# EAGLE design Toggle (EAGLE 7.3.0)
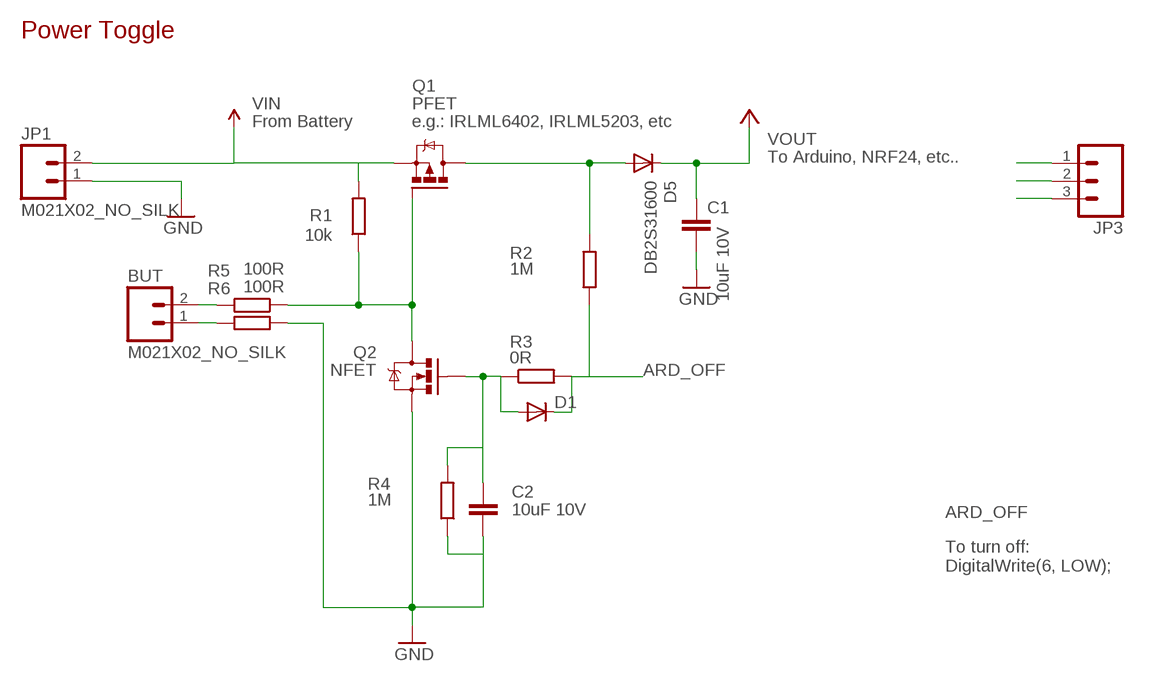
[diagram p0: schematic, sheet 1]

## Parts
BUT  M021X02_NO_SILK  [1X02_NO_SILK]
C1  10uF 10V  C-EUC0805  [C0805]
C2  10uF 10V  C-EUC0805  [C0805]
D1  DIODESOD523  [SOD523]
D5  DB2S31600  DIODESMA  [SMA-DIODE]
JP1  M021X02_NO_SILK  [1X02_NO_SILK]
JP3  M031X03_NO_SILK  [1X03_NO_SILK]
Q1  PFET  IRLML5203  [MICRO3]
Q2  NFET  MOSFET-NCHANNELBSS123LT1G  [SOT23]
R1  10k  R-EU_R0603  [R0603]
R2  1M  R-EU_R0603  [R0603]
R3  0R  R-EU_R0603  [R0603]
R4  1M  R-EU_R0603  [R0603]
R5  100R  R-EU_R0603  [R0603]
R6  100R  R-EU_R0603  [R0603]

## Nets
ARD_OFF: D1.C JP3.3 R2.1 R3.2
BUTTONS: Q1.1(G) Q2.3(D) R1.1 R5.1
GND: C1.2 C2.2 JP1.1 JP3.1 Q2.2(S) R4.1 R6.1
N$2: C2.1 D1.A Q2.1(G) R3.1 R4.2
N$3: BUT.2 R5.2
N$4: D5.A Q1.3(D) R2.2
N$5: BUT.1 R6.2
VIN: JP1.2 Q1.2(S) R1.2
VOUT: C1.1 D5.C JP3.2 ; supply symbol labelled VCC

## Notes on the sheet
- Power Toggle
- From Battery | e.g.: IRLML6402, IRLML5203, etc
- To Arduino, NRF24, etc..
- To turn off:
  DigitalWrite(6, LOW);

## Library data of the parts
BUT JP1 = SparkFun-Connectors:M02: Standard 2-pin 0.1" header. Use with - straight break away headers ( PRT-00116) - right angle break away headers (PRT-00553) - swiss pins (PRT-00743) - machine pins (PRT-00117) - female headers (PRT-00115) Molex polarized connector foot print use with: PRT-08233 with associated crimp pins and housings. 2.54_SCREWTERM for use with PRT-10571. 3.5mm Screw Terminal footprints for PRT-08084 5mm Screw Terminal footprints for use with PRT-08433
C1 C2 = wes:C-EU: CAPACITOR, European symbol
D1 D5 = SparkFun-DiscreteSemi:DIODE: Diode These are standard reverse protection diodes and small signal diodes. SMA package can handle up to about 1A. SOD-323 can handle about 200mA. What the SOD-323 package when ordering, there are some mfgs out there that are 5-pin packages.
JP3 = SparkFun-Connectors:M03: Header 3 Standard 3-pin 0.1" header. Use with straight break away headers (SKU : PRT-00116), right angle break away headers (PRT-00553), swiss pins (PRT-00743), machine pins (PRT-00117), and female headers (PRT-00115). Molex polarized connector foot print use with SKU : PRT-08232 with associated crimp pins and housings.
Q1 = transistor-power:IRLML5203: HEXFET P-Channel Power MOSFET
Q2 = SparkFun-DiscreteSemi:MOSFET-NCHANNEL: Common NMOSFET Parts MFG P/N Store ID Prod ID FDD8780 TRANS-09984 SI7820DN TRANS-11055 FDS6630A IC-08089 2N7002PW TRANS-11151 FQP30N06L COM-10213 TRANS-10060 BSS123LT1G TRANS-08345 BSS138 TRANS-00830 BS170 2N7000; PROD_ID: TRANS-08345
R1-R6 = wes:R-EU_: RESISTOR, European symbol

## Board
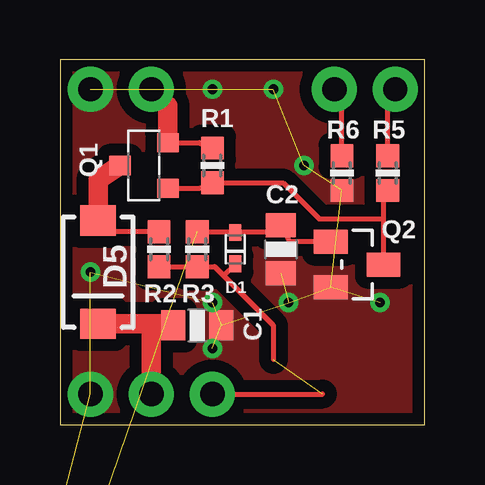
[diagram p1: board, top side]
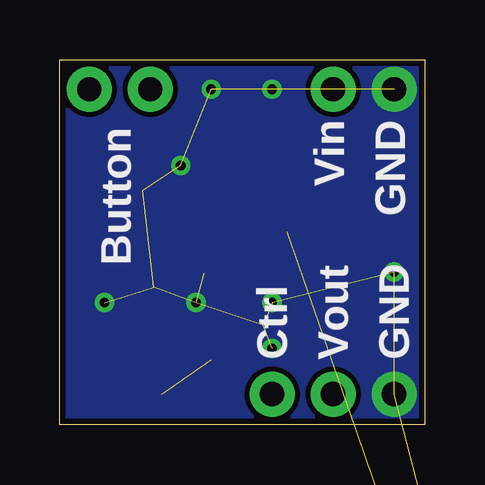
[diagram p2: board, bottom side, seen from below]

Size 15.19 x 15.19 mm. Coordinates in mm from the lower left corner, seen from the top.
Outline: 0,0 15.19,0 15.19,15.19 0,15.19 0,0
Copper layers (1*16): Top 0.035mm / dielectric 1.5mm / Bottom 0.035mm
Design rules "default *": minimum track width 8mil, minimum drill 0.3mm, track to track 8mil, track to pad 8mil, pad to pad 8mil, via to via 8mil, smd to smd 8mil, copper to edge 10mil, drill to drill 8mil, minimum pad ring 10mil, minimum via ring 8mil, stop-mask expansion 4mil, vias tented up to drill 30mil, thermal gap 10mil

### Footprints (pad centres in the part's own frame; a part is rotated, then mirrored left to right if it is on the bottom)
1X02_NO_SILK = drill 1.016 pad 1.88: 1 0,0; 2 2.54,0
C0805 = smd 1 x 1.25: 1 -1,0; 2 1,0
SOD523 = smd 0.7 x 0.5: A 0.7,0; C -0.6,0
SMA-DIODE = smd 1.27 x 1.47: A -2.15,0; C 2.15,0
1X03_NO_SILK = drill 1.016 pad 1.88: 1 0,0; 2 2.54,0; 3 5.08,0
MICRO3 = smd 0.8 x 0.9: 1 -0.95,-1; 2 0.95,-1; 3 0,1
SOT23 = smd 1 x 1.4: 1 -0.95,-1.1; 2 0.95,-1.1; 3 0,1.1
R0603 = smd 0.95 x 0.95: 1 -0.725,0; 2 0.725,0

### Placement (x,y rotation side)
BUT  11.43,13.97 0 top
C1  5.71,4.13 0 top
C2  9.21,7.3 270 top
D1  7.3,7.3 90 top
D5  1.59,6.35 270 top
JP1  1.27,13.97 0 top
JP3  1.27,1.27 0 top
Q1  3.49,10.79 90 top
Q2  12.38,6.67 270 top
R1  6.35,10.79 90 top
R2  4.13,7.3 90 top
R3  5.71,7.3 270 top
R4  0,-6.35 0 top  (outside the outline)
R5  13.65,10.48 90 top
R6  11.75,10.48 90 top

### Tracks (layer width: path | path; a pad name or v marks a point on that pad's centre or on a via)
ARD_OFF  (1 unrouted)
  Top 0.203: JP3.3 10.94,1.27 | R2.1 R3.2 6.44,6.58 6.83,6.19 | 8.89,2.71 8.89,4.13 6.83,6.19 | D1.C 7.3,6.67 6.83,6.19
BUTTONS
  Top 0.203: Q1.1 5.81,9.85 R1.1 9.3,10.07 10.79,8.57 13.48,8.57 | Q2.3 13.48,8.57 | 13.48,8.57 13.48,9.58 R5.1
GND  (via drill 0.4 pad 0.3)  (14 unrouted)
  other vias: 6.35,13.97 8.89,13.97 10.16,10.79 13.34,5.08 9.53,5.08 6.35,5.08 6.35,3.17 1.27,6.35
  pour Top (isolate 0.5, no thermals): -2.54,24.13 20.32,24.13 20.32,-3.81 -2.54,-3.81
  pour Bottom (no thermals): -2.54,17.14 17.14,17.14 17.14,-1.91 -2.54,-1.91
N$2  (1 unrouted)
  Top 0.203: R3.1 7.62,8.03 | 7.62,8.03 8.62,8.03 C2.1 9.57,7.62 Q2.1 | D1.A 7.59,8 7.62,8.03
N$3
  Top 0.203: R5.2 13.65,13.47 BUT.2
N$4
  Top 0.203: R2.2 1.74,8.03 D5.A
  Top 0.813: D5.A 1.59,10.21 Q1.3
N$5
  Top 0.203: R6.2 11.75,13.47 BUT.1
VIN
  Top 0.203: Q1.2 5.81,11.74 R1.2
  Top 0.813: Q1.2 4.49,13.29 JP1.2
VOUT
  Top 0.813: D5.C 3.81,4.2 | 3.81,4.2 4.64,4.2 C1.1 | JP3.2 3.81,4.2

### Text on the board
bNames: GND | Vin | Button | GND | Vout | Ctrl